# Altium schematic sheet MICROCONTROLLER.SchDoc
size A4; SheetNumber: 2; SheetTotal: 2
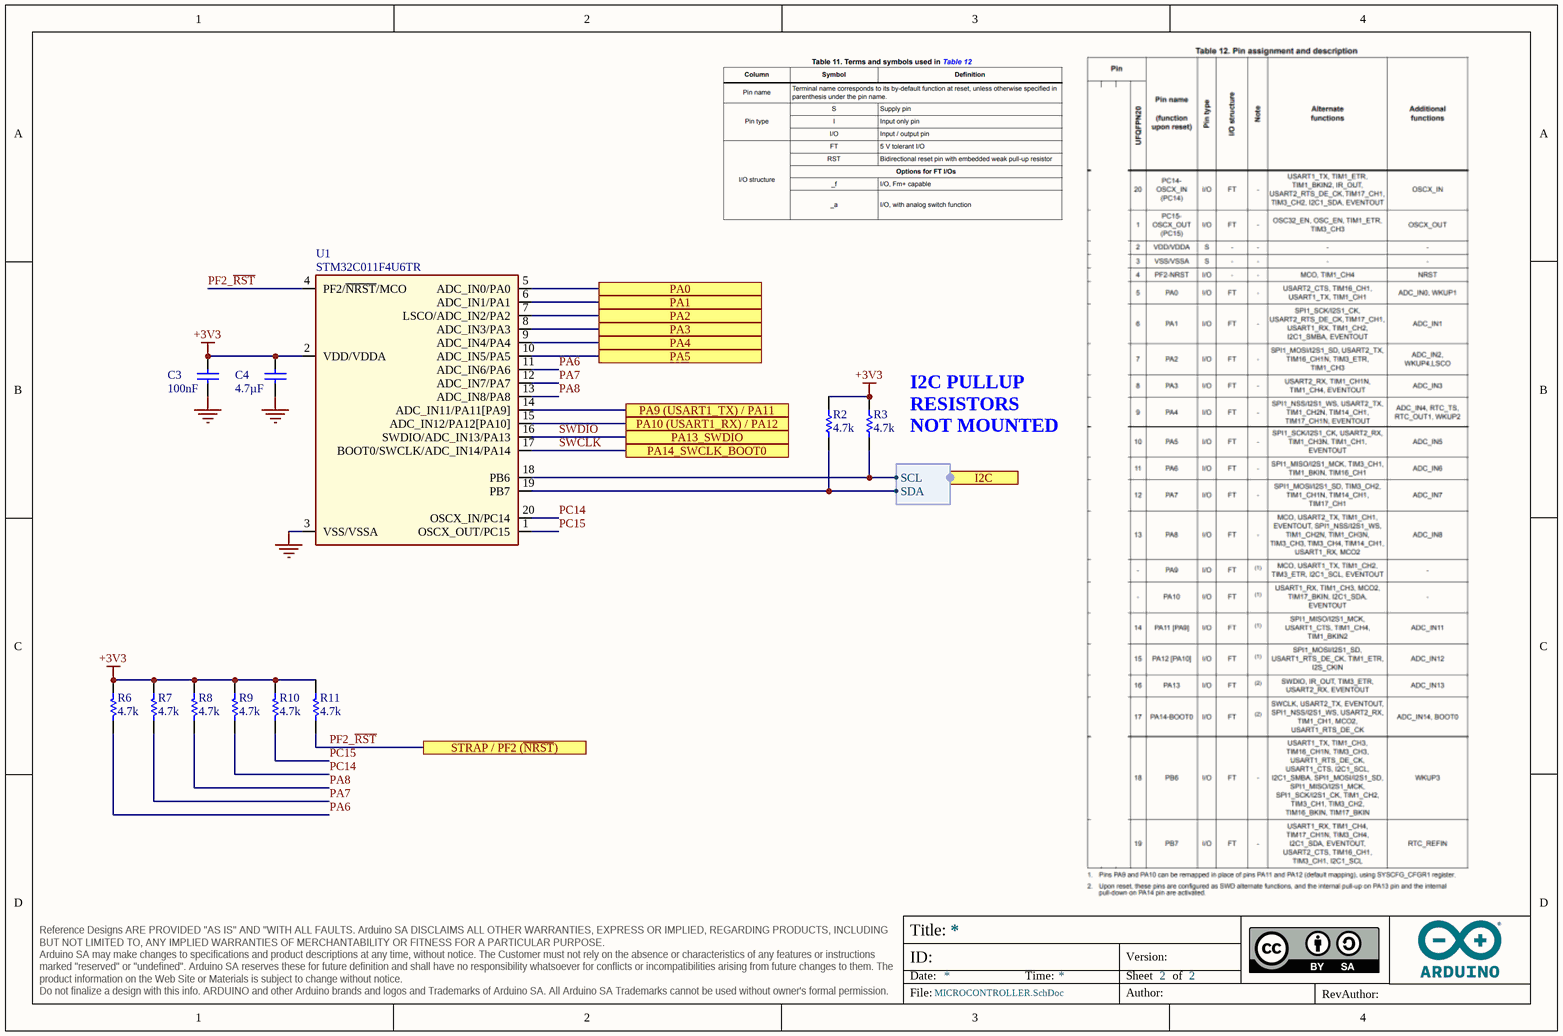
[diagram p0: MICROCONTROLLER.SchDoc]

## Parts
C3  value 100nF  [CAP-0402]  (hidden comment: 0402B104K160CT)
C4  value 4.7µF  [CAP-0603]  (hidden comment: GRM188R61C475KAAJD)
R2  value 4.7k  [RES-0402]  (hidden comment: RC0402FR-074K7L)
R3  value 4.7k  [RES-0402]  (hidden comment: RC0402FR-074K7L)
R6  value 4.7k  [RES-0402]  (hidden comment: RC0402FR-074K7L)
R7  value 4.7k  [RES-0402]  (hidden comment: RC0402FR-074K7L)
R8  value 4.7k  [RES-0402]  (hidden comment: RC0402FR-074K7L)
R9  value 4.7k  [RES-0402]  (hidden comment: RC0402FR-074K7L)
R10  value 4.7k  [RES-0402]  (hidden comment: RC0402FR-074K7L)
R11  value 4.7k  [RES-0402]  (hidden comment: RC0402FR-074K7L)
U1  STM32C011F4U6TR  [UFQFPN20]

## Ports
I2C (harness I2C), PA0, PA1, PA2, PA3, PA4, PA5, PA9 (USART1_TX) / PA11, PA10 (USART1_RX) / PA12, PA13_SWDIO, PA14_SWCLK_BOOT0, STRAP / PF2 (~{NRST})

## Harnesses
I2C: SDA, SCL

## Nets
+3V3: C3.1 C4.2 R2.2 R3.2 R6.1 R7.1 R8.1 R9.1 R10.1 R11.1 U1.2(VDD/VDDA)
GND: C3.2 C4.1 U1.3(VSS/VSSA)
PA0: U1.5(ADC_IN0/PA0) ; port PA0
PA1: U1.6(ADC_IN1/PA1) ; port PA1
PA2: U1.7(LSCO/ADC_IN2/PA2) ; port PA2
PA3: U1.8(ADC_IN3/PA3) ; port PA3
PA4: U1.9(ADC_IN4/PA4) ; port PA4
PA5: U1.10(ADC_IN5/PA5) ; port PA5
PA6: R6.2 U1.11(ADC_IN6/PA6)
PA7: R7.2 U1.12(ADC_IN7/PA7)
PA8: R8.2 U1.13(ADC_IN8/PA8)
PA9 (USART1_TX) / PA11: U1.14(ADC_IN11/PA11[PA9]) ; port PA9 (USART1_TX) / PA11
PA10 (USART1_RX) / PA12: U1.15(ADC_IN12/PA12[PA10]) ; port PA10 (USART1_RX) / PA12
PC14: R9.2 U1.20(OSCX_IN/PC14)
PC15: R10.2 U1.1(OSCX_OUT/PC15)
PF2_~{RST}: R11.2 U1.4(PF2/~{NRST}/MCO) ; port STRAP / PF2 (~{NRST})
SWCLK: U1.17(BOOT0/SWCLK/ADC_IN14/PA14) ; port PA14_SWCLK_BOOT0
SWDIO: U1.16(SWDIO/ADC_IN13/PA13) ; port PA13_SWDIO
NetR2_1: R2.1 U1.19(PB7) ; port I2C.SDA
NetR3_1: R3.1 U1.18(PB6) ; port I2C.SCL

## Notes on the sheet
- (near R3) I2C PULLUP RESISTORS NOT MOUNTED
- Title:
- ID:
- Date:
- Time:
- Version:
- Sheet
- of
- RevAuthor:
- Reference Designs ARE PROVIDED "AS IS" AND "WITH ALL FAULTS. Arduino SA DISCLAIMS ALL OTHER WARRANTIES, EXPRESS OR IMPLIED, REGARDING PRODUCTS, INCLUDING BUT NOT LIMITED TO, ANY IMPLIED WARRANTIES OF MERCHANTABILITY OR FITNESS FOR A PARTICULAR PURPOSE.
  Arduino SA may make changes to specifications and product descriptions at any time, without notice. The Customer must not rely on the absence or characteristics of any features or instructions marked "reserved" or "undefined". Arduino SA reserves these for future definition and shall have no responsibility whatsoever for conflicts or incompatibilities arising from future changes to them. The product information on the Web Site or Materials is subject to change without notice.
  Do not finalize a design with this info. ARDUINO and other Arduino brands and logos and Trademarks of Arduino SA. All Arduino SA Trademarks cannot be used without owner's formal permission.
- File:
- Author:

## Library data of the parts
C3 = C0012-A.15: CAP CHIP 0402 100nF 10% 16V X7R; Manufacturer: Walsin; Code Arduino: 0132; Dielectric: X7R; Part Number: 0402B104K160CT; Tolerance: 10%; Voltage: 16V; Case Code (Imperial): 0402; Technology: Ceramic
C4 = C0054-A.16: CAP CHIP 0603 4.7uF 10% 16V X5R; Manufacturer: Murata; Code Arduino: A5072; Dielectric: X5R; Technology: Ceramic; Part Number: GRM188R61C475KAAJD; Manufacturer 2: Murata; Case Code (Imperial): 0603; Tolerance: 10%; Manufacturer 3: Samsung Electro-Mechanics; Part number 3: CL10A475KO8NNNC; Part number 2: GRM188R61C475KE11D; Voltage: 16V
R2 R3 = R0013-A.24: RES CHIP 0402 4k7 1% 1/16W; Manufacturer: YAGEO; Code Arduino: 2196; Power: 62.5mW; Temperature coefficient: 200ppm; Part Number: RC0402FR-074K7L; Tolerance: 1%; Case Code (Imperial): 0402; Technology: Thick film
R6-R11 = R0013-A.24: RES CHIP 0402 4k7 1% 1/16W; Manufacturer: YAGEO; Power: 62.5mW; Code Arduino: 2196; Temperature coefficient: 200ppm; Tolerance: 1%; Case Code (Imperial): 0402; Part Number: RC0402FR-074K7L; Technology: Thick film
U1 = U0363-A.3: IC Cortex M0, 32b MCU, 32KB Flash, 6KB RAM, VDD 2-3.6V, -40°C to 85°C, QFN20 3x3mm; Manufacturer: ST Microelectronics; Code Arduino: U0363; Part Number: STM32C011F4U6TR